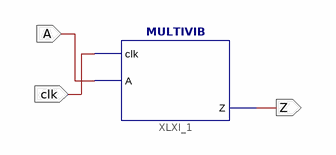
[diagram p0: schematic sheet 1]
// Xilinx ISE schematic mv.sch (spartan6) as structural Verilog: 1 symbols, 3 ports
module mv (
  input  clk,
  input  A,
  output Z
);

  MULTIVIB XLXI_1 (.A(A), .clk(clk), .Z(Z));
endmodule
